# EAGLE schematic lt3652 (EAGLE 6.2)
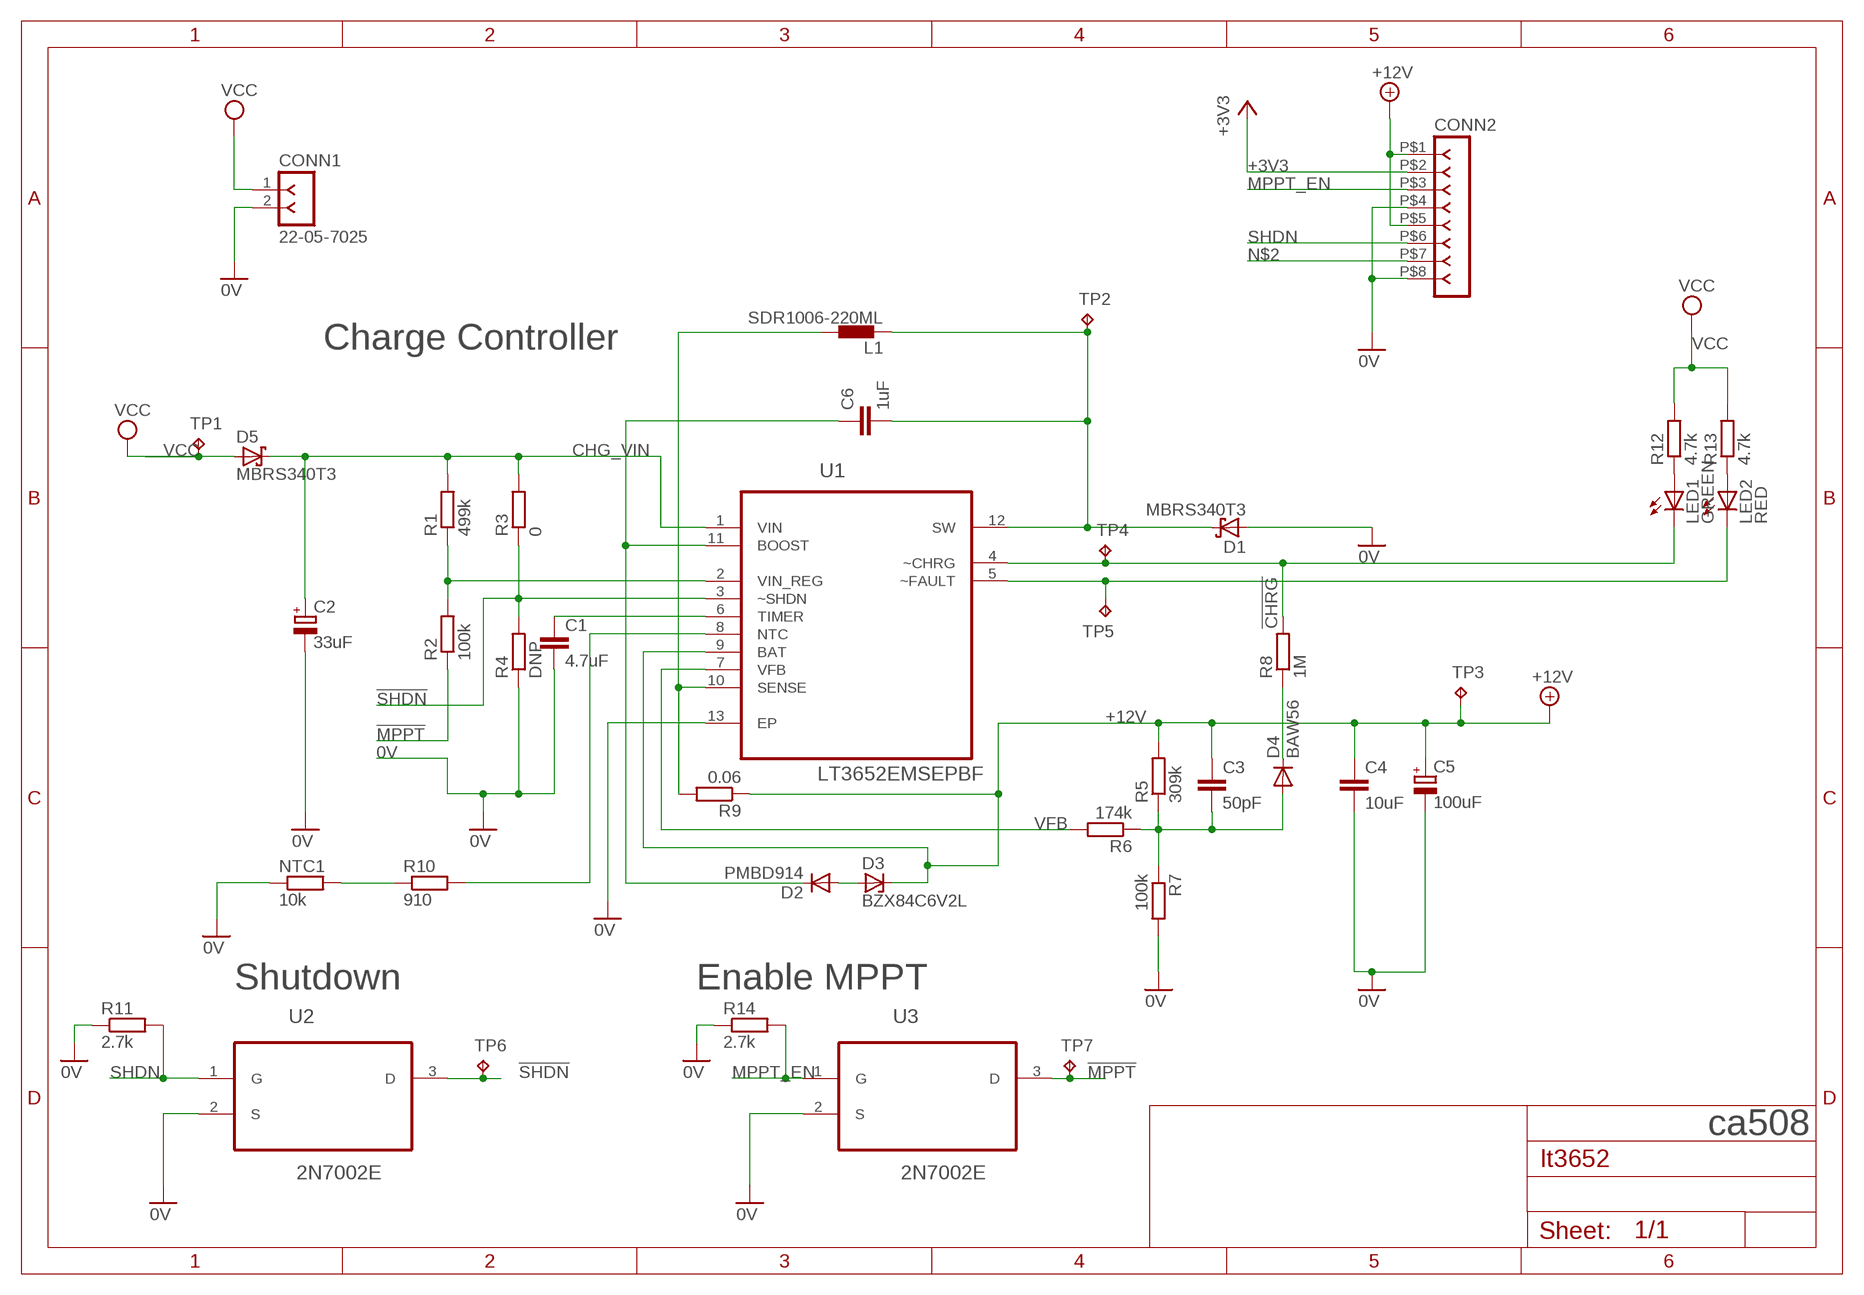
[diagram p0: schematic, sheet 1]

## Parts
C1  4.7uF  C-EUC1206  [C1206]
C2  33uF  CPOL-EUD  [PANASONIC_D]
C3  50pF  C-EUC0603  [C0603]
C4  10uF  C-EUC1206  [C1206]
C5  100uF  CPOL-EUF  [PANASONIC_F]
C6  1uF  C-EUC0805  [C0805]
CONN1  22-05-7025  [22-05-7025]
CONN2  39-28-1083  [39-28-1083]
D1  MBRS340T3  [SMC]
D2  PMBD914  DIODE  [SOT23]
D3  BZX84C6V2L  ZENER-DIODESOT23  [SOT23]
D4  BAW56  DIODE  [SOT23]
D5  MBRS340T3  [SMC]
L1  SDR1006-220ML  SDR1006-XXXKL  [SDR1006]
LED1  GREEN  LEDCHIPLED_0603  [CHIPLED_0603]
LED2  RED  LEDCHIPLED_0603  [CHIPLED_0603]
NTC1  10k  R-EU_R0603  [R0603]
R1  499k  R-EU_R0603  [R0603]
R2  100k  R-EU_R0603  [R0603]
R3  0  R-EU_R0603  [R0603]
R4  DNP  R-EU_R0603  [R0603]
R5  309k  R-EU_R0805  [R0805]
R6  174k  R-EU_R0805  [R0805]
R7  100k  R-EU_R0805  [R0805]
R8  1M  R-EU_R0805  [R0805]
R9  0.06  R-EU_R2512  [R2512]
R10  910  R-EU_R0603  [R0603]
R11  2.7k  R-EU_R0603  [R0603]
R12  4.7k  R-EU_R0805  [R0805]
R13  4.7k  R-EU_R0805  [R0805]
R14  2.7k  R-EU_R0603  [R0603]
TP1  TPTP07R  [TP07R]
TP2  TPTP07R  [TP07R]
TP3  TPTP07R  [TP07R]
TP4  TPTP07R  [TP07R]
TP5  TPTP07R  [TP07R]
TP6  TPTP07R  [TP07R]
TP7  TPTP07R  [TP07R]
U1  LT3652EMSEPBF  [SOP65P490X110-13N]
U2  2N7002E  [SOT95P230X110-3N]
U3  2N7002E  [SOT95P230X110-3N]

## Nets
0V: C1.2 C2.- C4.2 C5.- CONN1.2 CONN2.P$4 CONN2.P$8 D1.A NTC1.1 R4.1 R7.2 R11.1 R14.1 U1.13(EP) U2.2(S) U3.2(S)
!CHRG: LED1.C R8.2 TP4.TP U1.4(~CHRG)
!MPPT!: R2.1 TP7.TP U3.3(D)
!SHDN!: R3.1 R4.2 TP6.TP U1.3(~SHDN) U2.3(D)
+3V3: CONN2.P$2
+12V: C3.1 C4.1 C5.+ CONN2.P$1 CONN2.P$5 D3.3(C) R5.2 R9.1 TP3.TP U1.9(BAT)
CHG_VIN: C2.+ D5.C R1.2 R3.2 U1.1(VIN)
MPPT_EN: CONN2.P$3 R14.2 U3.1(G)
N$1: R1.1 R2.2 U1.2(VIN_REG)
N$2: CONN2.P$7
N$3: C6.2 D1.C L1.P$1 TP2.TP U1.12(SW)
N$4: C1.1 U1.6(TIMER)
N$5: C6.1 D2.3(C) U1.11(BOOST)
N$6: R10.2 U1.8(NTC)
N$7: D2.1(A) D3.1(A)
N$10: L1.P$2 R9.2 U1.10(SENSE)
N$11: C3.2 D4.1(A) R5.1 R6.1 R7.1
N$12: D4.3(C) R8.1
N$14: LED2.C TP5.TP U1.5(~FAULT)
N$16: NTC1.2 R10.1
N$17: LED1.A R12.1
N$18: LED2.A R13.1
SHDN: CONN2.P$6 R11.2 U2.1(G)
VCC: CONN1.1 D5.A R12.2 R13.2 TP1.TP
VFB: R6.2 U1.7(VFB)

## Notes on the sheet
- Charge Controller
- Shutdown | Enable MPPT
- ca508

## Library data of the parts
C1 C3 C4 C6 = resistor:C-EU: CAPACITOR, European symbol
C2 C5 = resistor:CPOL-EU: POLARIZED CAPACITOR, European symbol
CONN1 = farnellparts:22-05-7025
CONN2 = farnellparts:39-28-1083
D1 D5 = diode:MBRS3*0T3: SCHOTTKY BARRIER RECTIFIER 3.0 AMPERES 20, 30, 40 VOLT Source: MBRS340T3-D.pdf
D2 D4 = farnellparts:DIODE
D3 = diode:ZENER-DIODE: Z-Diode
L1 = farnellparts:SDR1006-XXXKL
LED1 LED2 = led:LED: LED OSRAM: - CHIPLED LG R971, LG N971, LY N971, LG Q971, LY Q971, LO R971, LY R971 LH N974, LH R974 LS Q976, LO Q976, LY Q976 LO Q996 - Hyper CHIPLED LW Q18S LB Q993, LB Q99A, LB R99A - SideLED LS A670, LO A670, LY A670, LG A670, LP A670 LB A673, LV A673, LT A673, LW A673 LH A674 LY A675 LS A676, LA A676, LO A676, LY A676, LW A676 LS A679, LY A679, LG A679 - Hyper Micro SIDELED® LS Y876, LA Y876, LO Y876, LY Y876 LT Y87S - SmartLED LW L88C, LW L88S LB L89C, LB L89S, LG L890 LS L89K, LO L89K, LY L89K LS L896, LA L896, LO L896, LY L896 - TOPLED LS T670, LO T670, LY T670, LG T670, LP T670 LSG T670, LSP T670, LSY T670, LOP T670, LYG T670 LG T671, LOG T671, LSG T671 LB T673, LV T673, LT T673, LW T673 LH T674 LS T676, LA T676, LO T676, LY T676, LB T676, LH T676, LSB T676, LW T676 LB T67C, LV T67C, LT T67C, LS T67K, LO T67K, LY T67K, LW E67C LS E67B, LA E67B, LO E67B, LY E67B, LB E67C, LV E67C, LT E67C LW T67C LS T679, LY T679, LG T679 LS T770, LO T770, LY T770, LG T770, LP T770 LB T773, LV T773, LT T773, LW T773 LH T774 LS E675, LA E675, LY E675, LS T675 LS T776, LA T776, LO T776, LY T776, LB T776 LHGB T686 LT T68C, LB T68C - Hyper Mini TOPLED® LB M676 - Mini TOPLED Santana® LG M470 LS M47K, LO M47K, LY M47K Source: http://www.osram.convergy.de LUXEON: - LUMILED® LXK2-PW12-R00, LXK2-PW12-S00, LXK2-PW14-U00, LXK2-PW14-V00 LXK2-PM12-R00, LXK2-PM12-S00, LXK2-PM14-U00 LXK2-PE12-Q00, LXK2-PE12-R00, LXK2-PE12-S00, LXK2-PE14-T00, LXK2-PE14-U00 LXK2-PB12-K00, LXK2-PB12-L00, LXK2-PB12-M00, LXK2-PB14-N00, LXK2-PB14-P00, LXK2-PB14-Q00 LXK2-PR12-L00, LXK2-PR12-M00, LXK2-PR14-Q00, LXK2-PR14-R00 LXK2-PD12-Q00, LXK2-PD12-R00, LXK2-PD12-S00 LXK2-PH12-R00, LXK2-PH12-S00 LXK2-PL12-P00, LXK2-PL12-Q00, LXK2-PL12-R00 Source: www.luxeon.com KINGBRIGHT: KA-3528ASYC Source: www.kingbright.com
NTC1 R1-R14 = resistor:R-EU_: RESISTOR, European symbol
TP1-TP7 = testpad:TP: Test pad
U1 = farnellparts:LT3652EMSEPBF; DESCRIPTION: Power Tracking 2A Battery Charger for Solar Power; MPN: LT3652EMSE#PBF; OC_FARNELL: 1839126; OC_NEWARK: 64R8539; PACKAGE: MSOP-12; SUPPLIER: Linear Technology
U2 U3 = farnellparts:2N7002E: N-channel TrenchMOS FET; MPN: 2N7002E; OC_FARNELL: 1894721; OC_NEWARK: 55T7740; PACKAGE: SOT-3; SUPPLIER: NXP